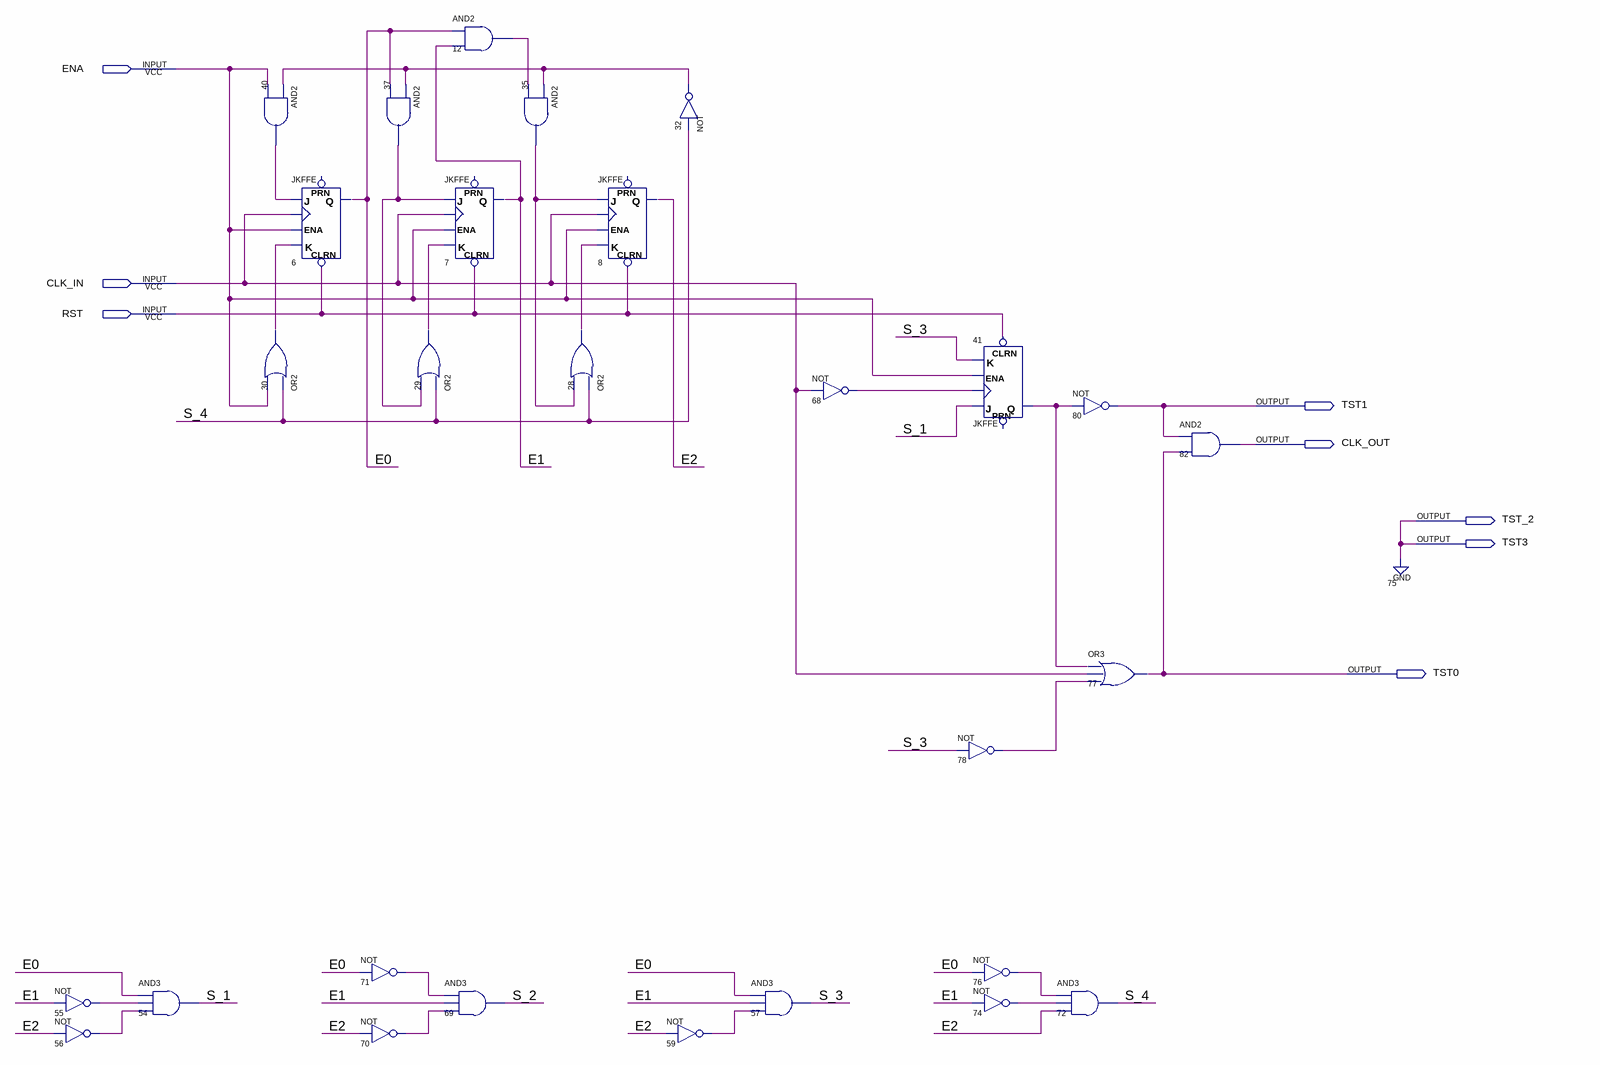
[diagram p0: schematic sheet]
// Quartus schematic div5-1123.bdf as structural Verilog: 28 symbols, 8 pins
module \div5-1123  (
  input  ENA,
  input  CLK_IN,
  input  RST,
  output TST1,
  output CLK_OUT,
  output TST_2,
  output TST3,
  output TST0
);

  wire E0, E1, E2, n12_out, n28_out, n29_out, n30_out, n32_out, n35_out, n37_out, n40_out, n41_q, n55_out,
       n56_out, n59_out, n68_out, n70_out, n71_out, n74_out, n76_out, n78_out, S_1, S_2, S_3, S_4;

  not u_55 (n55_out, E1);
  not u_56 (n56_out, E2);
  and u_54 (S_1, E0, n55_out, n56_out);
  and u_40 (n40_out, n32_out, ENA);
  JKFFE u_6 (.J(n40_out), .CLK(CLK_IN), .CLRN(RST), .K(n30_out), .ENA(ENA), .Q(E0));  // open: PRN
  or u_30 (n30_out, S_4, ENA);
  not u_71 (n71_out, E0);
  not u_70 (n70_out, E2);
  and u_37 (n37_out, n32_out, E0);
  or u_29 (n29_out, S_4, n37_out);
  and u_12 (n12_out, E0, E1);
  JKFFE u_7 (.J(n37_out), .CLK(CLK_IN), .CLRN(RST), .K(n29_out), .ENA(ENA), .Q(E1));  // open: PRN
  and u_69 (S_2, n71_out, E1, n70_out);
  and u_35 (n35_out, n32_out, n12_out);
  JKFFE u_8 (.J(n35_out), .CLK(CLK_IN), .CLRN(RST), .K(n28_out), .ENA(ENA), .Q(E2));  // open: PRN
  or u_28 (n28_out, S_4, n35_out);
  not u_59 (n59_out, E2);
  not u_32 (n32_out, S_4);
  and u_57 (S_3, E0, E1, n59_out);
  not u_68 (n68_out, CLK_IN);
  JKFFE u_41 (.J(S_1), .CLK(n68_out), .CLRN(RST), .K(S_3), .ENA(ENA), .Q(n41_q));  // open: PRN
  not u_78 (n78_out, S_3);
  not u_76 (n76_out, E0);
  not u_74 (n74_out, E1);
  not u_80 (TST1, n41_q);
  or u_77 (TST0, n41_q, CLK_IN, n78_out);
  and u_72 (S_4, n76_out, n74_out, E2);
  and u_82 (CLK_OUT, TST1, TST0);

  assign TST3 = 1'b0;
  assign TST_2 = 1'b0;
endmodule
